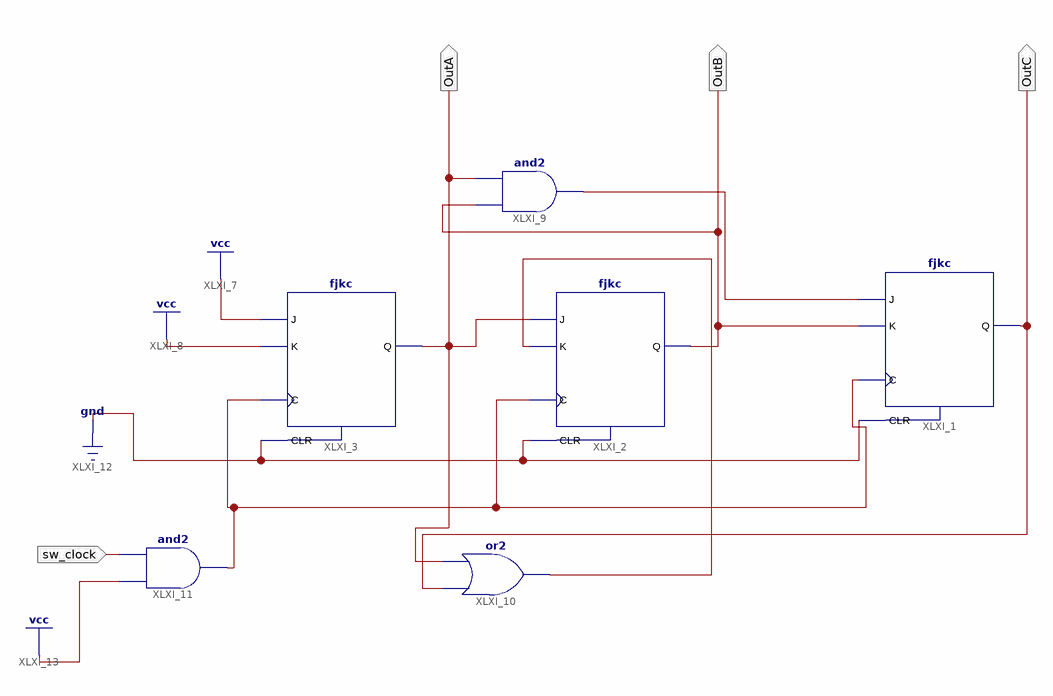
[diagram p0: schematic sheet 1]
// Xilinx ISE schematic flipflip16.sch (spartan6) as structural Verilog: 6 symbols, 4 ports
module flipflip16 (
  input  sw_clock,
  output OutA,
  output OutC,
  output OutB
);

  wire XLXN_6, XLXN_10, XLXN_17;

  fjkc XLXI_3 (.C(XLXN_17), .CLR(1'b0), .J(1'b1), .K(1'b1), .Q(OutA));
  fjkc XLXI_2 (.C(XLXN_17), .CLR(1'b0), .J(OutA), .K(XLXN_10), .Q(OutB));
  fjkc XLXI_1 (.C(XLXN_17), .CLR(1'b0), .J(XLXN_6), .K(OutB), .Q(OutC));
  and XLXI_9 (XLXN_6, OutB, OutA);
  or XLXI_10 (XLXN_10, OutC, OutA);
  and XLXI_11 (XLXN_17, 1'b1, sw_clock);
endmodule
